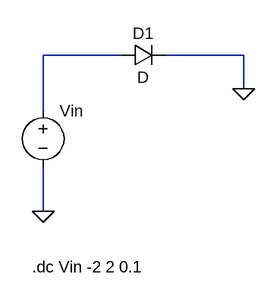
[diagram p0: schematic Lab 4 - Sec A #1.asc]
Lab 4 - Sec A #1.asc, the LTspice schematic file:
Version 4
SHEET 1 880 680
WIRE 128 112 16 112
WIRE 304 112 192 112
WIRE 304 160 304 112
WIRE 16 192 16 112
WIRE 16 336 16 272
FLAG 16 336 0
FLAG 304 160 0
SYMBOL diode 128 128 R270
WINDOW 0 32 32 VTop 2
WINDOW 3 0 32 VBottom 2
SYMATTR InstName D1
SYMBOL voltage 16 176 R0
SYMATTR InstName Vin
SYMATTR Value ""
TEXT 0 416 Left 2 !.dc Vin -2 2 0.1

The netlist it stands for:
* Lab 4 - Sec A #1.asc
D1 N001 0 D
Vin N001 0
.model D D
.lib standard.dio
.dc Vin -2 2 0.1
.backanno
.end